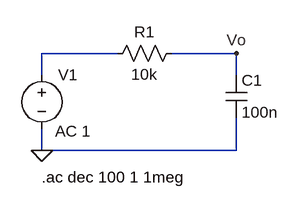
[diagram p0: schematic Circuito.asc]
Circuito.asc, the LTspice schematic file:
Version 4
SHEET 1 880 680
WIRE 128 112 16 112
WIRE 304 112 208 112
WIRE 16 144 16 112
WIRE 304 144 304 112
WIRE 16 256 16 224
WIRE 304 256 304 208
WIRE 304 256 16 256
FLAG 16 256 0
FLAG 304 112 Vo
SYMBOL voltage 16 128 R0
WINDOW 123 20 100 Left 2
WINDOW 39 0 0 Left 0
SYMATTR Value2 AC 1
SYMATTR InstName V1
SYMATTR Value ""
SYMBOL res 224 96 R90
WINDOW 0 0 56 VBottom 2
WINDOW 3 32 56 VTop 2
SYMATTR InstName R1
SYMATTR Value 10k
SYMBOL cap 288 144 R0
SYMATTR InstName C1
SYMATTR Value 100n
TEXT 16 296 Left 2 !.ac dec 100 1 1meg

The netlist it stands for:
* Circuito.asc
V1 N001 0 AC 1
R1 Vo N001 10k
C1 Vo 0 100n
.ac dec 100 1 1meg
.backanno
.end

* Results of the author's LTspice run, read from the files saved beside the schematic
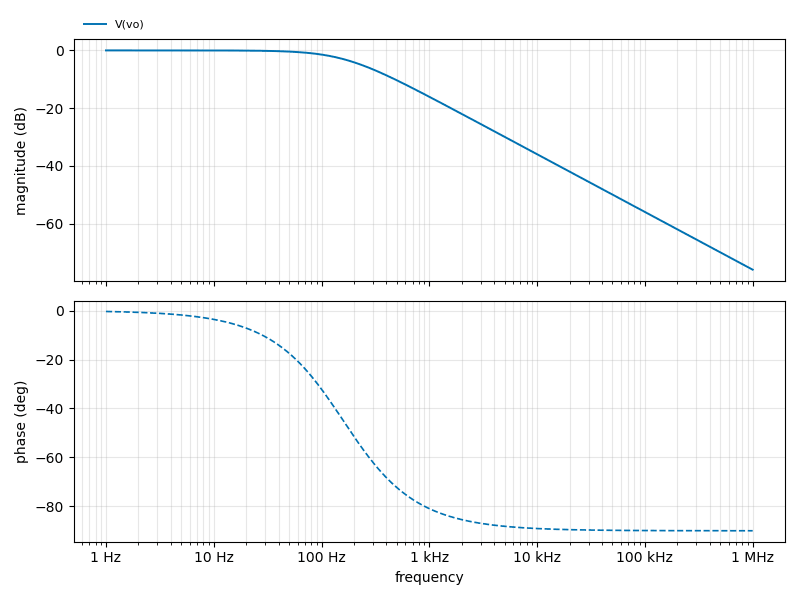
[diagram p1: AC Analysis of Circuito.asc, plotted from the saved traces]
* AC Analysis, 1 run:
*   V(vo): -0.00 dB at 1 Hz, -75.96 dB at 1 MHz, peak -0.00 dB at 1 Hz, 3 dB below the peak at 159.2 Hz